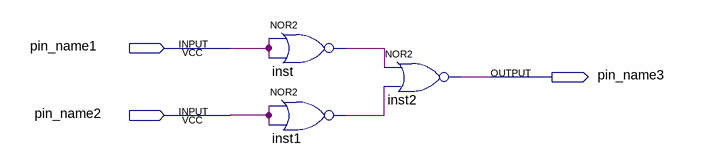
[diagram p0: schematic sheet]
// Quartus schematic third.bdf as structural Verilog: 3 symbols, 3 pins
module third (
  input  pin_name1,
  input  pin_name2,
  output pin_name3
);

  wire inst1_out, inst_out;

  nor inst (inst_out, pin_name1, pin_name1);
  nor inst1 (inst1_out, pin_name2, pin_name2);
  nor inst2 (pin_name3, inst_out, inst1_out);
endmodule
